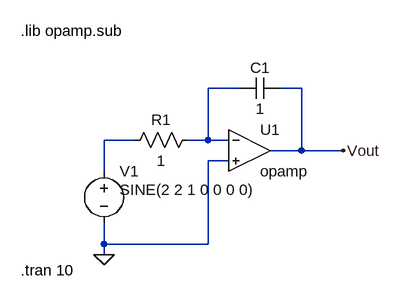
[diagram p0: schematic Integrator.asc]
Integrator.asc, the LTspice schematic file:
Version 4
SHEET 1 880 680
WIRE 224 112 176 112
WIRE 320 112 288 112
WIRE 64 192 16 192
WIRE 176 192 176 112
WIRE 176 192 144 192
WIRE 208 192 176 192
WIRE 320 208 320 112
WIRE 320 208 272 208
WIRE 384 208 320 208
WIRE 208 224 176 224
WIRE 16 240 16 192
WIRE 16 352 16 320
WIRE 176 352 176 224
WIRE 176 352 16 352
WIRE 16 368 16 352
FLAG 16 368 0
FLAG 384 208 Vout
SYMBOL Opamps\\opamp 240 144 R0
SYMATTR InstName U1
SYMBOL voltage 16 224 R0
WINDOW 3 24 44 Left 2
WINDOW 123 0 0 Left 2
WINDOW 39 0 0 Left 2
SYMATTR Value SINE(2 2 1 0 0 0 0)
SYMATTR InstName V1
SYMBOL res 160 176 R90
WINDOW 0 0 56 VBottom 2
WINDOW 3 32 56 VTop 2
SYMATTR InstName R1
SYMATTR Value 1
SYMBOL cap 288 96 R90
WINDOW 0 0 32 VBottom 2
WINDOW 3 32 32 VTop 2
SYMATTR InstName C1
SYMATTR Value 1
TEXT -112 24 Left 2 !.lib opamp.sub
TEXT -112 392 Left 2 !.tran 10

The netlist it stands for:
* Integrator.asc
XU1 N001 0 Vout opamp Aol=100K GBW=10Meg  ; pins invin noninvin out
V1 N002 0 SINE(2 2 1 0 0 0 0)
R1 N001 N002 1
C1 Vout N001 1
.lib opamp.sub
.tran 10
.backanno
.end